# Altium schematic sheet Main.SchDoc
size B
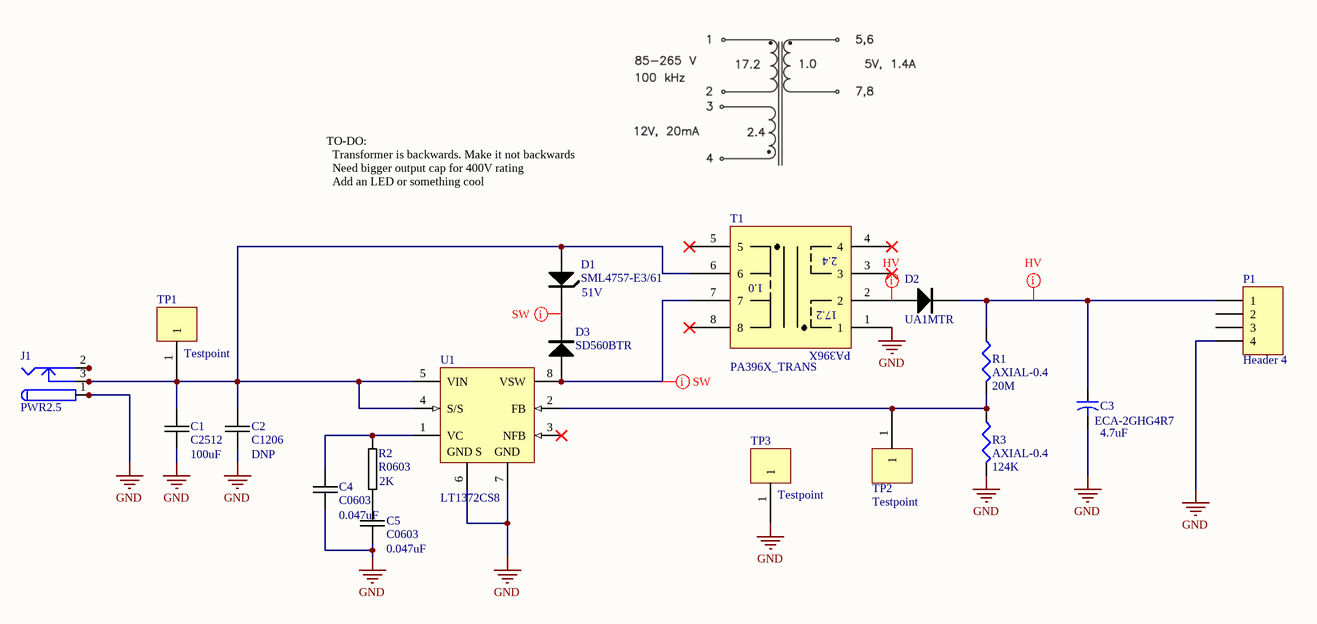
[diagram p0: Main.SchDoc]

## Parts
C1  C2512  value 100uF  [2512R-GENERIC]
C2  C1206  value DNP  [1206C-GENERIC]
C3  PartNumber: ECA-2GHG4R7  [CAP_10MM]  (hidden comment: 4.7uF)
C4  C0603  value 0.047uF  [0603C-TBD]
C5  C0603  value 0.047uF  [0603C-TBD]
D1  SML4757-E3/61  value 51V  [DO214AA]
D2  UA1MTR  [DO214AA]
D3  SD560BTR  [DO214AA]
J1  PWR2.5  [KLD-0202]
P1  Header 4  [HDR1X4]
R1  AXIAL-0.4  value 20M  [AXIAL-0.4]
R2  R0603  value 2K  [0603R-TBD]
R3  AXIAL-0.4  value 124K  [AXIAL-0.4]
T1  PA396X_TRANS  [Trans18x15.6]
TP1  Testpoint  [1206_Testpoint]
TP2  Testpoint  [1206_Testpoint]
TP3  Testpoint  [1206_Testpoint]
U1  LT1372CS8  [LT-S8-8_N]

## Nets
GND: C1.2 C2.2 C3.2 C4.2 C5.2 J1.1 J1.1A J1.1B P1.4 R3.2 T1.1 TP3.1 U1.6(GND_S) U1.7(GND)
NetC1_1: C1.1 C2.1 D1.A J1.3 J1.3A J1.3B T1.6 TP1.1 U1.4(S/S) U1.5(VIN)
NetC3_1: C3.1 D2.K P1.1 R1.1
NetC4_1: C4.1 R2.1 U1.1(VC)
NetC5_1: C5.1 R2.2
NetD1_K: D1.K D3.K
NetD2_A: D2.A T1.2
NetD3_A: D3.A T1.7 U1.8(VSW)
NetJ1_2: J1.2 J1.2A J1.2B
NetR1_2: R1.2 R3.1 TP2.1 U1.2(FB)

Not connected (* = marked no-connect by the designer): P1 2 3; T1 3* 4* 5* 8*; U1 3(NFB)*

## Layout directives
net class HV: NetC3_1, NetD2_A
net class SW: NetD1_K, NetD3_A

## Notes on the sheet
- TO-DO:
  Transformer is backwards. Make it not backwards
  Need bigger output cap for 400V rating
  Add an LED or something cool
- Title
- Size:
- Date:
- B
- Number:
- Time:
- Revision:
- Sheet
- of
- File:
- (in symbol PA396X_TRANS) 2.4; 1.0; 17.2; PA396X

## Library data of the parts
C1 = 0805C-TBD
C2 = 0805C-TBD: CAPACITOR 0805 CERAMIC VALUE TO BE DETERMINED
C3 = Cap2: Capacitor; Published: 23-Sep-2002; PackageReference: CAPR-10X12.5; Publisher: Altium Limited; PackageDescription: Capacitor; 2 Leads; Value: 4.7uF
C4 C5 = 0603C-TBD: CAPACITOR 0603 CERAMIC VALUE TO BE DETERMINED; REEL: *
D1 = DIODE-ZENER-GENERIC: GENERIC ZENER DIODE
D2 D3 = DIODE-GENERIC: GENERIC DIODE
J1 = PWR2.5: Low Voltage Power Supply Connector; Published: 17-Dec-2003; DatasheetDocument: 09-May-2002; Publisher: Altium Limited; ComponentLink1Description: Manufacturer Link; ComponentLink1URL: http://domino.kycon.com/internet/Products.html
P1 = Header 4: Header, 4-Pin; LatestRevisionDate: 17-Jul-2002; LatestRevisionNote: Re-released for DXP Platform.; Publisher: Altium Limited
R1 R3 = Res3: Resistor; Published: 8-Jun-2000; LatestRevisionDate: 29-May-2009; LatestRevisionNote: IPC-7351 Footprint Added.; PackageReference: AXIAL-0.4; Publisher: Altium Limited; PackageDescription: Chip Resistor
R2 = 0603R-TBD: RESISTOR 0603 VALUE TO BE DETERMINED
U1 = LT1372CS8: 500 kHz High Efficiency 1.5 A Switching Regulator, 8-pin SOIC (S8-8), 0 to 125 degC; Manufacturer: Linear Technology; Frequency Sync Range: 600kHz - 800kHz; Number of Outputs: 1; DatasheetVersion: Rev. B; PackageVersion: Rev. G, 03/2012; PackageReference: S8-8; PackageDescription: 8-Pin Plastic Small Outline (Narrow .150 Inch), Body 4.9 x 3.9 mm, Pitch 1.27 mm; Supplier 1: Digi-Key; Supplier Part Number 1: LT1372CS8-ND; Supplier 2: Newark; Supplier Part Number 2: 57M3606; RoHS: FALSE; Mounting Technology: Surface Mount; PartNumber: LT1372CS8; ComponentLink1Description: Manufacturer URL; ComponentLink1URL: http://www.linear.com/; ComponentLink2Description: Datasheet; ComponentLink2URL: http://cds.linear.com/docs/en/datasheet/13727fbs.pdf; ComponentLink3Description: Package Specification; ComponentLink3URL: http://cds.linear.com/docs/en/packaging/05081610_G_SO8.pdf